# EAGLE design Gira (EAGLE 7.3.0)
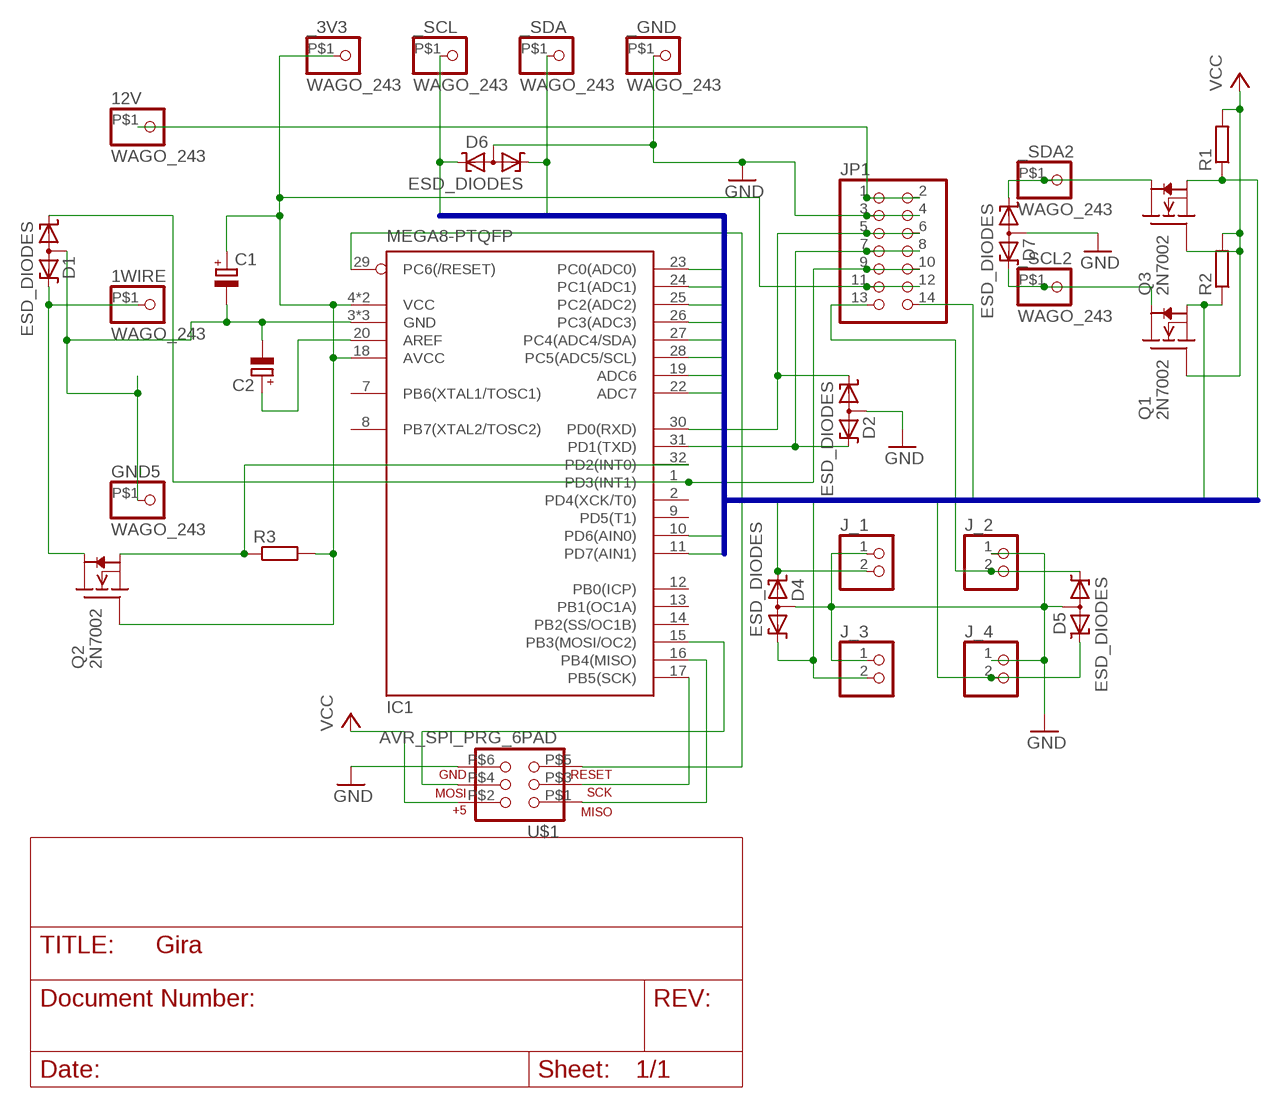
[diagram p0: schematic, sheet 1]

## Parts
1WIRE  WAGO_243  [WAGO_243]
12V  WAGO_243  [WAGO_243]
_3V3  WAGO_243  [WAGO_243]
_GND  WAGO_243  [WAGO_243]
_SCL  WAGO_243  [WAGO_243]
_SCL2  WAGO_243  [WAGO_243]
_SDA  WAGO_243  [WAGO_243]
_SDA2  WAGO_243  [WAGO_243]
C1  CP1206  [CP1206]
C2  CP1206  [CP1206]
D1  ESD_DIODES  [SOT23]
D2  ESD_DIODES  [SOT23]
D4  ESD_DIODES  [SOT23]
D5  ESD_DIODES  [SOT23]
D6  ESD_DIODES  [SOT23]
D7  ESD_DIODES  [SOT23]
GND5  WAGO_243  [WAGO_243]
IC1  MEGA8-PTQFP  [TQFP32-08]
J_1  PINHD-1X2LEVER  [1X02_GN]
J_2  PINHD-1X2LEVER  [1X02_GN]
J_3  PINHD-1X2LEVER  [1X02_GN]
J_4  PINHD-1X2LEVER  [1X02_GN]
JP1  PINHD-2X7  [2X07]
Q1  2N7002  [SOT23]
Q2  2N7002  [SOT23]
Q3  2N7002  [SOT23]
R1  R-EU_R0603  [R0603]
R2  R-EU_R0603  [R0603]
R3  R-EU_R0603  [R0603]
U$1  AVR_SPI_PRG_6PAD  [2X3_PAD]

## Nets
3V3 [power]: _3V3.P$1 C1.+ IC1.4(VCC) IC1.6(VCC) IC1.18(AVCC) JP1.11 JP1.12 Q2.1(G) R3.2 U$1.P$2 ; supply symbol labelled VCC
B1: D4.2(K2) IC1.23(PC0(ADC0)) J_1.2
B2: D5.1(K1) IC1.24(PC1(ADC1)) J_2.2
B3: D4.1(K1) IC1.25(PC2(ADC2)) J_3.2
B4: D5.2(K2) IC1.26(PC3(ADC3)) J_4.2
GND [power]: _GND.P$1 C1.- C2.- D1.3(AA) D2.3(AA) D4.3(AA) D5.3(AA) D6.3(AA) D7.3(AA) GND5.P$1 IC1.3(GND) IC1.5(GND) IC1.21(GND) J_1.1 J_2.1 J_3.1 J_4.1 JP1.3 JP1.4 U$1.P$6
N$1: C2.+ IC1.20(AREF)
N$2: IC1.32(PD2(INT0)) Q2.2(S) R3.1
N$3: 1WIRE.P$1 D1.2(K2) Q2.3(D)
N$4: _SDA2.P$1 D7.1(K1) Q3.3(D)
N$5: _SCL2.P$1 D7.2(K2) Q1.3(D)
N$8: IC1.15(PB3(MOSI/OC2)) U$1.P$4
N$9: IC1.16(PB4(MISO)) U$1.P$1
N$10: IC1.17(PB5(SCK)) U$1.P$3
N$11: IC1.29(PC6(/RESET)) U$1.P$5
N$12 [power]: 12V.P$1 JP1.1 JP1.2
N$14: D2.2(K2) IC1.31(PD1(TXD)) JP1.7 JP1.8
N$15: D2.1(K1) IC1.30(PD0(RXD)) JP1.5 JP1.6
N$16: D1.1(K1) IC1.1(PD3(INT1)) JP1.9 JP1.10
RESET: IC1.10(PD6(AIN0)) JP1.13
SCL: _SCL.P$1 D6.2(K2) IC1.22(ADC7)
SCL2: IC1.28(PC5(ADC5/SCL)) Q1.2(S) R2.1
SDA: _SDA.P$1 D6.1(K1) IC1.19(ADC6)
SDA2: IC1.27(PC4(ADC4/SDA)) Q3.2(S) R1.1
TEST: IC1.11(PD7(AIN1)) JP1.14
VCC: Q1.1(G) Q3.1(G) R1.2 R2.2
Unconnected: IC1.2(PD4(XCK/T0)) IC1.7(PB6(XTAL1/TOSC1)) IC1.8(PB7(XTAL2/TOSC2)) IC1.9(PD5(T1)) IC1.12(PB0(ICP)) IC1.13(PB1(OC1A)) IC1.14(PB2(SS/OC1B))

## Buses
B1,B2,B3,B4,SDA,SCL,TEST,RESET,SDA2,SCL2

## Library data of the parts
1WIRE 12V _3V3 _GND _SCL _SCL2 _SDA _SDA2 GND5 = common:WAGO_243
C1 C2 = common:CP: POLARIZED CAPACITOR, European symbol
D1 D2 D4-D7 = common:ESD_DIODES: ESD Diodes
IC1 = common:MEGA8-P: MICROCONTROLLER 8 Kbytes FLASH, 1 kbytes SRAM, 512 bytes EEPROM, USART, 4-channel 10 bit ADC, 2-channel 8 bit ADC Pin compatible with Atmega48, ATMega88, ATMega168 Source: avr.lbr
J_1-J_4 = common:PINHD-1X2: PIN HEADER
JP1 = pinhead:PINHD-2X7: PIN HEADER
Q1-Q3 = common:2N7002: N-Channel Enhancement MOSFET 60 V; 115 mA; 1.2…14 Ohm
R1-R3 = common:R-EU_: RESISTOR, European symbol
U$1 = common:AVR_SPI_PRG_6: AVR ISP 6 Pin This is the reduced ISP connector for AVR programming. Common on Arduino. This footprint will take up less PCB space and can be used with a 10-pin to 6-pin adapter such as SKU: BOB-08508

## Net classes
0 default: width 0.35 mm
1 power: width 1 mm, clearance 0.35 mm

## Board
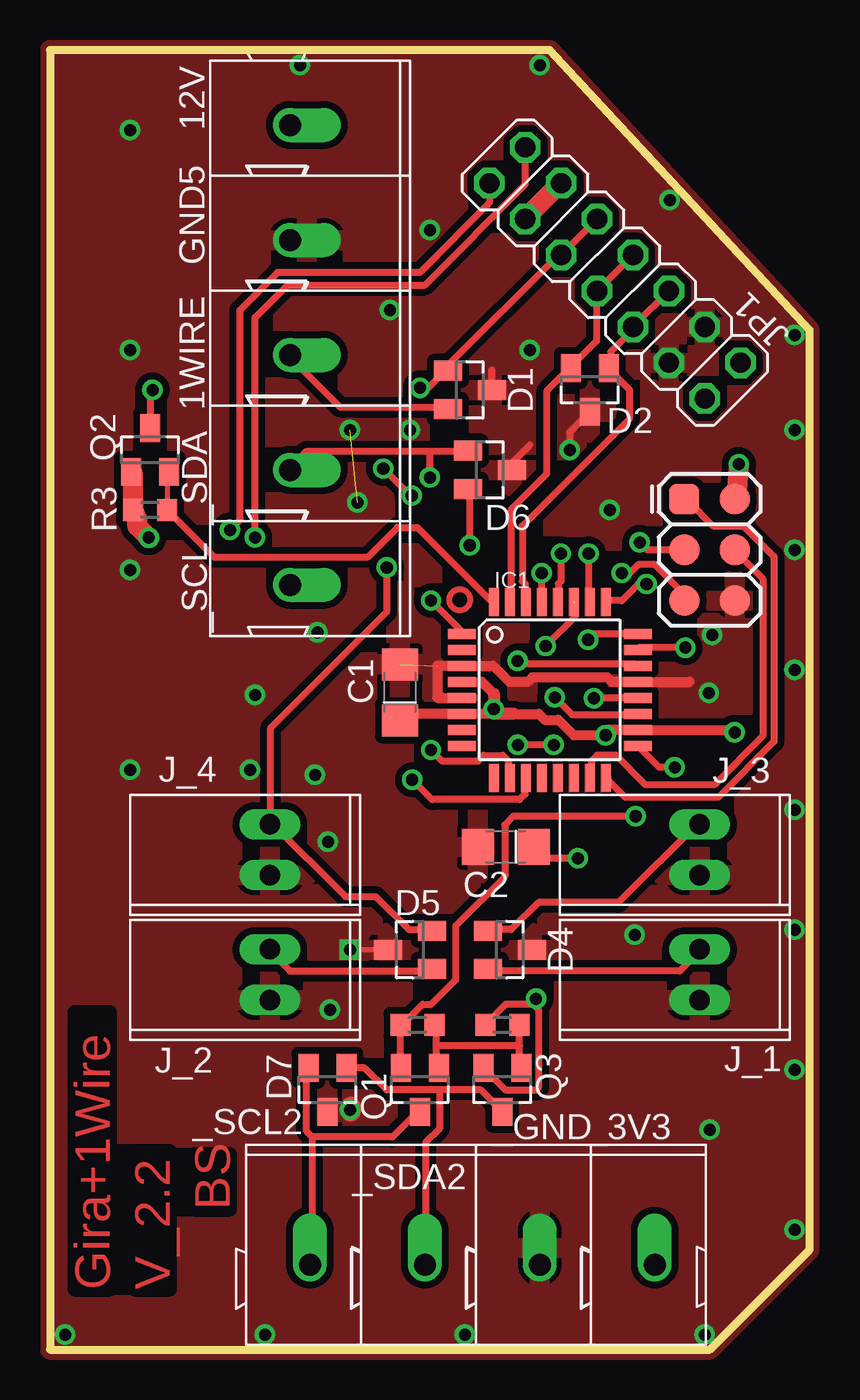
[diagram p1: board, top side]
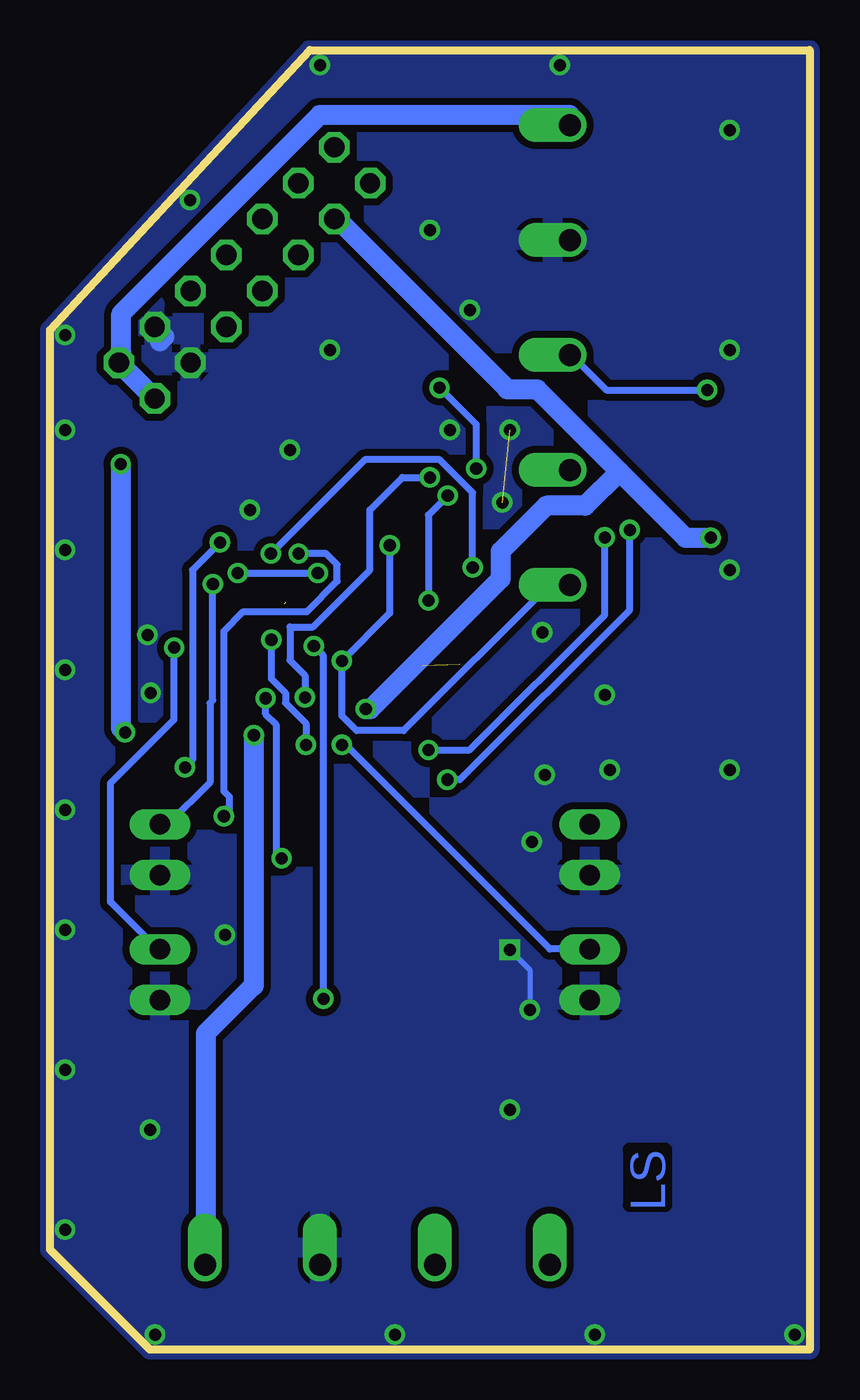
[diagram p2: board, bottom side, seen from below]

Size 38 x 65 mm. Coordinates in mm from the lower left corner, seen from the top.
Outline: 0,0 33,0 38,5 38,51 25,65 0,65 0,0
Copper layers (1*16): Top 0.035mm / dielectric 1.5mm / Bottom 0.035mm
Design rules "default *": minimum track width 0.35mm, minimum drill 24mil, track to track 8mil, track to pad 8mil, pad to pad 8mil, via to via 8mil, smd to smd 8mil, copper to edge 0mil, drill to drill 8mil, minimum pad ring 10mil, minimum via ring 8mil, stop-mask expansion 4mil, vias tented up to drill 0mil, thermal gap 10mil

### Footprints (pad centres in the part's own frame; a part is rotated, then mirrored left to right if it is on the bottom)
WAGO_243 = drill 1.1 pad 1.7 offset: P$1 0,0
CP1206 = smd 1.6 x 1.8: + 1.4,0; - -1.4,0
SOT23 = smd 1 x 1.4: 1 -0.95,-1.1; 2 0.95,-1.1; 3 0,1.1
TQFP32-08 = smd 1.4 x 0.5: 1 -4.4,2.8; 2 -4.4,2; 3 -4.4,1.2; 4 -4.4,0.4; 5 -4.4,-0.4; 6 -4.4,-1.2; 7 -4.4,-2; 8 -4.4,-2.8; 17 4.4,-2.8; 18 4.4,-2; 19 4.4,-1.2; 20 4.4,-0.4; 21 4.4,0.4; 22 4.4,1.2; 23 4.4,2; 24 4.4,2.8 | smd 0.5 x 1.4: 9 -2.8,-4.4; 10 -2,-4.4; 11 -1.2,-4.4; 12 -0.4,-4.4; 13 0.4,-4.4; 14 1.2,-4.4; 15 2,-4.4; 16 2.8,-4.4; 25 2.8,4.4; 26 2,4.4; 27 1.2,4.4; 28 0.4,4.4; 29 -0.4,4.4; 30 -1.2,4.4; 31 -2,4.4; 32 -2.8,4.4
1X02_GN = drill 1.016 long: 1 -1.27,0; 2 1.27,0
2X07 = drill 1.016 octagon: 1 -7.62,-1.27; 2 -7.62,1.27; 3 -5.08,-1.27; 4 -5.08,1.27; 5 -2.54,-1.27; 6 -2.54,1.27; 7 0,-1.27; 8 0,1.27; 9 2.54,-1.27; 10 2.54,1.27; 11 5.08,-1.27; 12 5.08,1.27; 13 7.62,-1.27; 14 7.62,1.27
R0603 = smd 1 x 1.1: 1 -0.85,0; 2 0.85,0
2X3_PAD = smd 1.524 x 1.524: P$1 -2.54,-1.27; P$2 -2.54,1.27; P$3 0,-1.27; P$4 0,1.27; P$5 2.54,-1.27; P$6 2.54,1.27

### Placement (x,y rotation side)
1WIRE  12,49.75 0 top
12V  12,61.25 0 top
_3V3  30.25,4.25 90 top
_GND  24.5,4.25 90 top
_SCL  12,38.25 0 top
_SCL2  13,4.25 90 top
_SDA  12,44 0 top
_SDA2  18.75,4.25 90 top
C1  17.5,32.88 270 top
C2  22.8,25.15 0 top
D1  21,48 270 top
D2  27,48 180 top
D4  23,20 270 top
D5  18,20 90 top
D6  22,44 270 top
D7  13.88,13 180 top
GND5  12,55.5 0 top
IC1  25,33 0 top
J_1  32.5,18.75 90 top
J_2  11,18.75 90 top
J_3  32.5,25 90 top
J_4  11,25 90 top
JP1  28.27,53.85 135 top
Q1  18.5,13 180 top
Q2  5,45 0 top
Q3  22.62,13 180 top
R1  22.62,16.25 0 top
R2  18.38,16.25 0 top
R3  5,42 180 top
U$1  33,40 270 top

### Tracks (layer width: path | path; a pad name or v marks a point on that pad's centre or on a via)
3V3  (via drill 0.6, 0.61)
  Top 0.35: 34.25,31 v34.25,30.88
  Top 0.5: 22.2,31.8 22,31.8 | 22,31.8 IC1.6 17.5,31.8 | IC1.4 21.6,33.4 22.2,32.8 | 34.25,31 IC1.18 27.8,31 v27.8,30.73 26.2,30.73 25.43,31.5 24.75,31.5 24.45,31.8 23.2,31.8 | v22.2,32.03 22,31.83 22,31.8
  Top 0.6: 17.5,31.8 C1.+
  Top 0.61: 23.2,31.8 22.2,31.8 | 22.2,32.8 v22.2,32.03
  Top 1: Q2.1 4.14,43.81 4.14,42.09 R3.2 4.37,41.52 4.37,41.18 v4.94,40.61 | JP1.11 25.52,58.32 23.8,56.61 JP1.12 | v34.46,44.29 34.32,42.43 U$1.P$2 | v34.25,30.88 34.23,30.85
  Bottom 1: v27.8,30.73 27.8,18.2 30.2,15.8 30.2,4.26 _3V3.P$1 | v4.94,40.61 6.2,40.61 9.52,43.92 | 9.52,43.92 13.63,48.03 15.12,48.03 23.69,56.61 JP1.12 | v22.2,32.03 21.98,32.03 15.46,38.55 15.46,39.92 13.17,42.21 11.23,42.21 9.52,43.92 | v34.46,44.29 34.46,31.09 v34.25,30.88
B1  (via drill 0.61)
  Top 0.35: D4.2 21.97,18.93 31.51,18.93 32.48,19.89 J_1.2 | v31.79,35.11 29.44,35.11 IC1.23
  Bottom 0.35: v31.79,35.11 31.79,31.51 34.97,28.33 34.97,22.38 32.62,20.03 J_1.2
B2  (via drill 0.6, 0.61)
  Top 0.35: D5.1 19.06,18.93 12.01,18.93 11.04,19.89 J_2.2 | IC1.24 29.3,35.8 27.23,35.8 v26.93,35.49 | v25.2,30.25 v23.4,30.25
  Bottom 0.35: J_2.2 11.04,20.03 13,20.03 23.25,30.28 v23.4,30.25 | v26.93,35.49 26.93,33.55 26.23,32.85 26.23,32.35 25.2,31.33 v25.2,30.25
B3  (via drill 0.61)
  Top 0.35: D4.1 21.97,21 23.07,21 24.43,22.35 28.44,22.35 32.48,26.39 J_3.2 | v29.85,38.29 29.44,38.29 28.61,37.46 27.91,37.46 IC1.25
  Bottom 0.35: v29.85,38.29 29.85,32.48 30,32.33 30,28.38 32.1,26.27 J_3.2 32.48,26.39
B4  (via drill 0.61)
  Top 0.35: D5.2 19.06,21 17.96,21 16.3,22.66 14.78,22.66 11.04,26.39 J_4.2 11.04,26.53 11.04,31.1 16.85,36.91 v16.85,39.12 | v26.95,39.81 26.95,37.46 IC1.26
  Bottom 0.35: v26.95,39.81 22.25,44.51 18.51,44.51 16.85,42.85 v16.85,39.12
GND  (via drill 0.6)  (2 unrouted)
  Top 0.25: 16.14,20 | 16.14,20 v15,20
  Top 0.35: D6.3 23.1,44.35 24,45.25 | D1.3 22.1,49 | D2.3 26,45.9 v26,45
  Top 0.5: 32,33.4 IC1.21 28.1,33.4 27.88,33.62 24.12,33.62 23.9,33.4 22.98,33.4 22.18,34.2 IC1.3 19.38,34.2 19.38,32.6 IC1.5
  Top 1: 23,43.98 D6.3 | v15,12 15.05,12.15 15.05,11.9
  Bottom 0.25: v15,20 14,19 v14,17
  Bottom 1: JP1.3 32.49,50.44 32.27,50.66
  other vias: 33,11 4,39 13.9,25.4 10,29 19,56 13.38,35.88 4,61 4,50 4,29 37.25,27 37.25,34 37.25,40 37.25,46 37.25,21 37.25,14 37.25,6 37.25,50.75 31,57.5 24.5,64.25 12.5,64.25 32.75,0.75 20.75,0.75 10.75,0.75 0.75,0.75 17,52 33.12,35.75 32.97,32.85 10.25,32.75 13.25,28.75 29.25,20.75 24,50 28,42 18,46 15,46 15.38,42.38
  pour Top: 0,65 0,0 33,0 38,5 38,51 25,65
  pour Bottom: 0,65 0,0 33,0 38,5 38,51 25,65
N$1  (via drill 0.61)
  Top 0.35: IC1.20 27.31,32.6 v27.21,32.58 | v26.41,24.57 24.78,24.57 C2.+
  Bottom 0.35: v27.21,32.58 27.21,31.77 26.67,31.23 26.67,24.83 v26.41,24.57
N$2
  Top 0.254: R3.1 5.86,42.09 5.86,43.81 Q2.2
  Top 0.35: 22.11,37.46 IC1.32 22.1,37.4 18.38,41.12 17.38,41.12 15.88,39.62 8.22,39.62 R3.1 5.93,41.88
N$3  (via drill 0.6)
  Top 0.254: 5.06,46.21 Q2.3
  Top 0.35: D1.2 19.89,47.14 14.5,47.14 12.01,49.63 1WIRE.P$1 | v5.12,48 5,47.88 Q2.3
  Bottom 0.35: v5.12,48 10.17,48 11.92,49.75 1WIRE.P$1
N$4
  Top 0.35: 19.48,12.98 21.55,12.98 22.52,12.01 Q3.3 | 19.48,12.98 16.85,12.98 15.75,14.09 14.91,14.09 D7.1 | 19.48,12.98 19.48,11.04 18.79,10.35 18.79,4.27 _SDA2.P$1
N$5
  Top 0.35: 13.12,10.63 12.84,10.9 12.84,14.09 D7.2 | 13.12,10.63 17.13,10.63 18.37,11.87 Q1.3 | 13.12,10.63 13.12,4.27 _SCL2.P$1
N$8
  Top 0.35: IC1.15 27.09,28.61 27.09,29.44 27.36,29.71 28.33,29.71 29.79,28.25 33.23,28.25 35.66,30.68 35.66,38.56 34.28,39.95 U$1.P$4
N$9
  Top 0.254: 31.8,42.43 U$1.P$1
  Top 0.35: 27.91,28.61 IC1.16 28.77,27.62 33.43,27.62 36.21,30.41 36.21,39.67 34.69,41.19 33.17,41.19 31.93,42.44 U$1.P$1
N$10  (via drill 0.6)
  Top 0.254: 29.4,30.09 IC1.17
  Top 0.35: U$1.P$3 29.88,40 v29.5,40.38 | v31.25,29.12 30.48,29.12 IC1.17
  Bottom 0.35: v29.5,40.38 30.88,39 30.88,29.5 v31.25,29.12
N$11  (via drill 0.61)
  Top 0.254: 31.69,37.41 U$1.P$5
  Top 0.35: v24.6,38.84 24.6,37.46 IC1.29 | v28.61,38.84 29.02,38.84 29.44,39.26 30.27,39.26 31.65,37.87 31.65,37.6 U$1.P$5
  Bottom 0.35: v28.61,38.84 v24.6,38.84
N$12
  Bottom 1: JP1.1 34.43,49.86 34.43,51.81 24.49,61.75 12,61.75 12V.P$1
  Bottom 1.016: JP1.1 JP1.2
N$14
  Top 0.35: JP1.7 27.5,53.09 JP1.8 27.36,52.81 27.36,50.46 26.12,49.21 D2.2 25.98,49.08 24.84,47.94 24.84,43.79 23.07,42.02 23.07,37.46 IC1.31
N$15
  Top 0.35: JP1.5 29.3,51.29 JP1.6 29.16,51.01 28.05,49.91 28.05,49.21 D2.1 27.95,49.05 29,48 29,46.56 23.63,41.19 23.63,38.43 23.77,38.29 23.77,37.46 IC1.30
  Bottom 0.35: JP1.6
N$16  (via drill 0.61)
  Top 0.35: JP1.9 25.7,54.88 JP1.10 25.43,54.75 19.89,49.21 D1.1 19.76,48.94 18.93,48.11 v18.51,48.11 | v19.06,37.46 20.59,35.94 IC1.1 | v16.68,44.06 18.1,42.69 v18.1,42.71
  Bottom 0.35: v19.06,37.46 19.06,41.74 v18.1,42.71 | v16.68,44.06 16.68,46.27 v18.51,48.11
RESET  (via drill 0.6, 0.61)
  Top 0.35: v19.06,29.99 19.62,29.44 21.41,29.44 21.69,29.71 22.66,29.71 22.94,29.44 22.94,28.61 IC1.10 | v10.25,40.62 10.25,51.62 11.88,53.25 18.75,53.25 23.78,58.28 JP1.13
  Bottom 0.35: v19.06,29.99 17.01,29.99 10.25,36.75 v10.25,40.62
SCL  (via drill 0.61)
  Top 0.35: IC1.22 29.3,34.28 23.56,34.28 v23.39,34.44 | v21,40.22 21,42.99 D6.2
  Bottom 0.35: _SCL.P$1 12.01,38.15 13.12,38.15 20.31,30.96 22.66,30.96 23.39,31.69 v23.39,34.44 21,36.84 v21,40.22
SCL2  (via drill 0.61)
  Top 0.35: Q1.2 17.54,14.22 17.54,16.16 R2.1 17.68,16.3 18.65,17.27 19.06,17.27 20.31,18.51 20.31,21.21 22.75,23.65 22.75,26.25 23.17,26.67 v29.3,26.67 | v25.56,39.81 25.56,38.43 25.43,38.29 25.43,37.46 IC1.28
  Bottom 0.35: v25.56,39.81 24.18,39.81 23.63,39.26 23.63,38.43 25.15,36.91 28.33,36.91 29.3,35.94 29.3,27.91 29.02,27.64 29.02,26.95 v29.3,26.67
SDA  (via drill 0.6)
  Top 0.35: 19,44.93 12.84,44.93 12.01,44.1 _SDA.P$1 | 19,44.93 20.86,44.93 D6.1 | IC1.19 29.35,31.75 26.12,31.75 v25.25,32.62 | v19,43.62 19,44.93
  Bottom 0.35: v19,43.62 20.38,43.62 22,42 22,39 24.85,36.15 26,36.15 26,34.48 25.25,33.73 v25.25,32.62
SDA2  (via drill 0.61)  (1 unrouted)
  Top 0.35: 24.18,17.27 22.8,17.27 21.83,16.3 R1.1 | 24.18,17.27 24.46,16.99 24.46,13.12 24.32,12.98 22.8,12.98 21.69,14.09 Q3.2 | v24.32,17.54 24.18,17.41 24.18,17.27 | 26.26,37.32 26.26,36.65 v24.8,35.19
  Bottom 0.35: v24.32,17.54 24.32,34.71 v24.8,35.19
TEST  (via drill 0.6, 0.61)
  Top 0.35: IC1.11 23.77,28.47 23.77,27.78 23.49,27.5 19.12,27.5 v18.12,28.5 | v9,41 9.5,41.5 9.5,52 11.38,53.88 18.5,53.88 21.98,57.36 JP1.14
  Bottom 0.35: v9,41 9,37 17.5,28.5 v18.12,28.5
VCC
  Top 0.35: 19.34,15.19 19.34,14.22 Q1.1 | 19.34,15.19 19.34,16.16 R2.2 | 23.49,15.19 23.49,14.22 Q3.1 | 23.49,15.19 23.49,16.16 R1.2 | 23.49,15.19 19.34,15.19
(copper drawn outside any net)
  shapes: Top circle x1

### Text on the board
Top: BS | Gira+1Wire | V_2.2
Bottom: LS